# EAGLE design quantum_PSU_V2 (EAGLE 9.5.2)
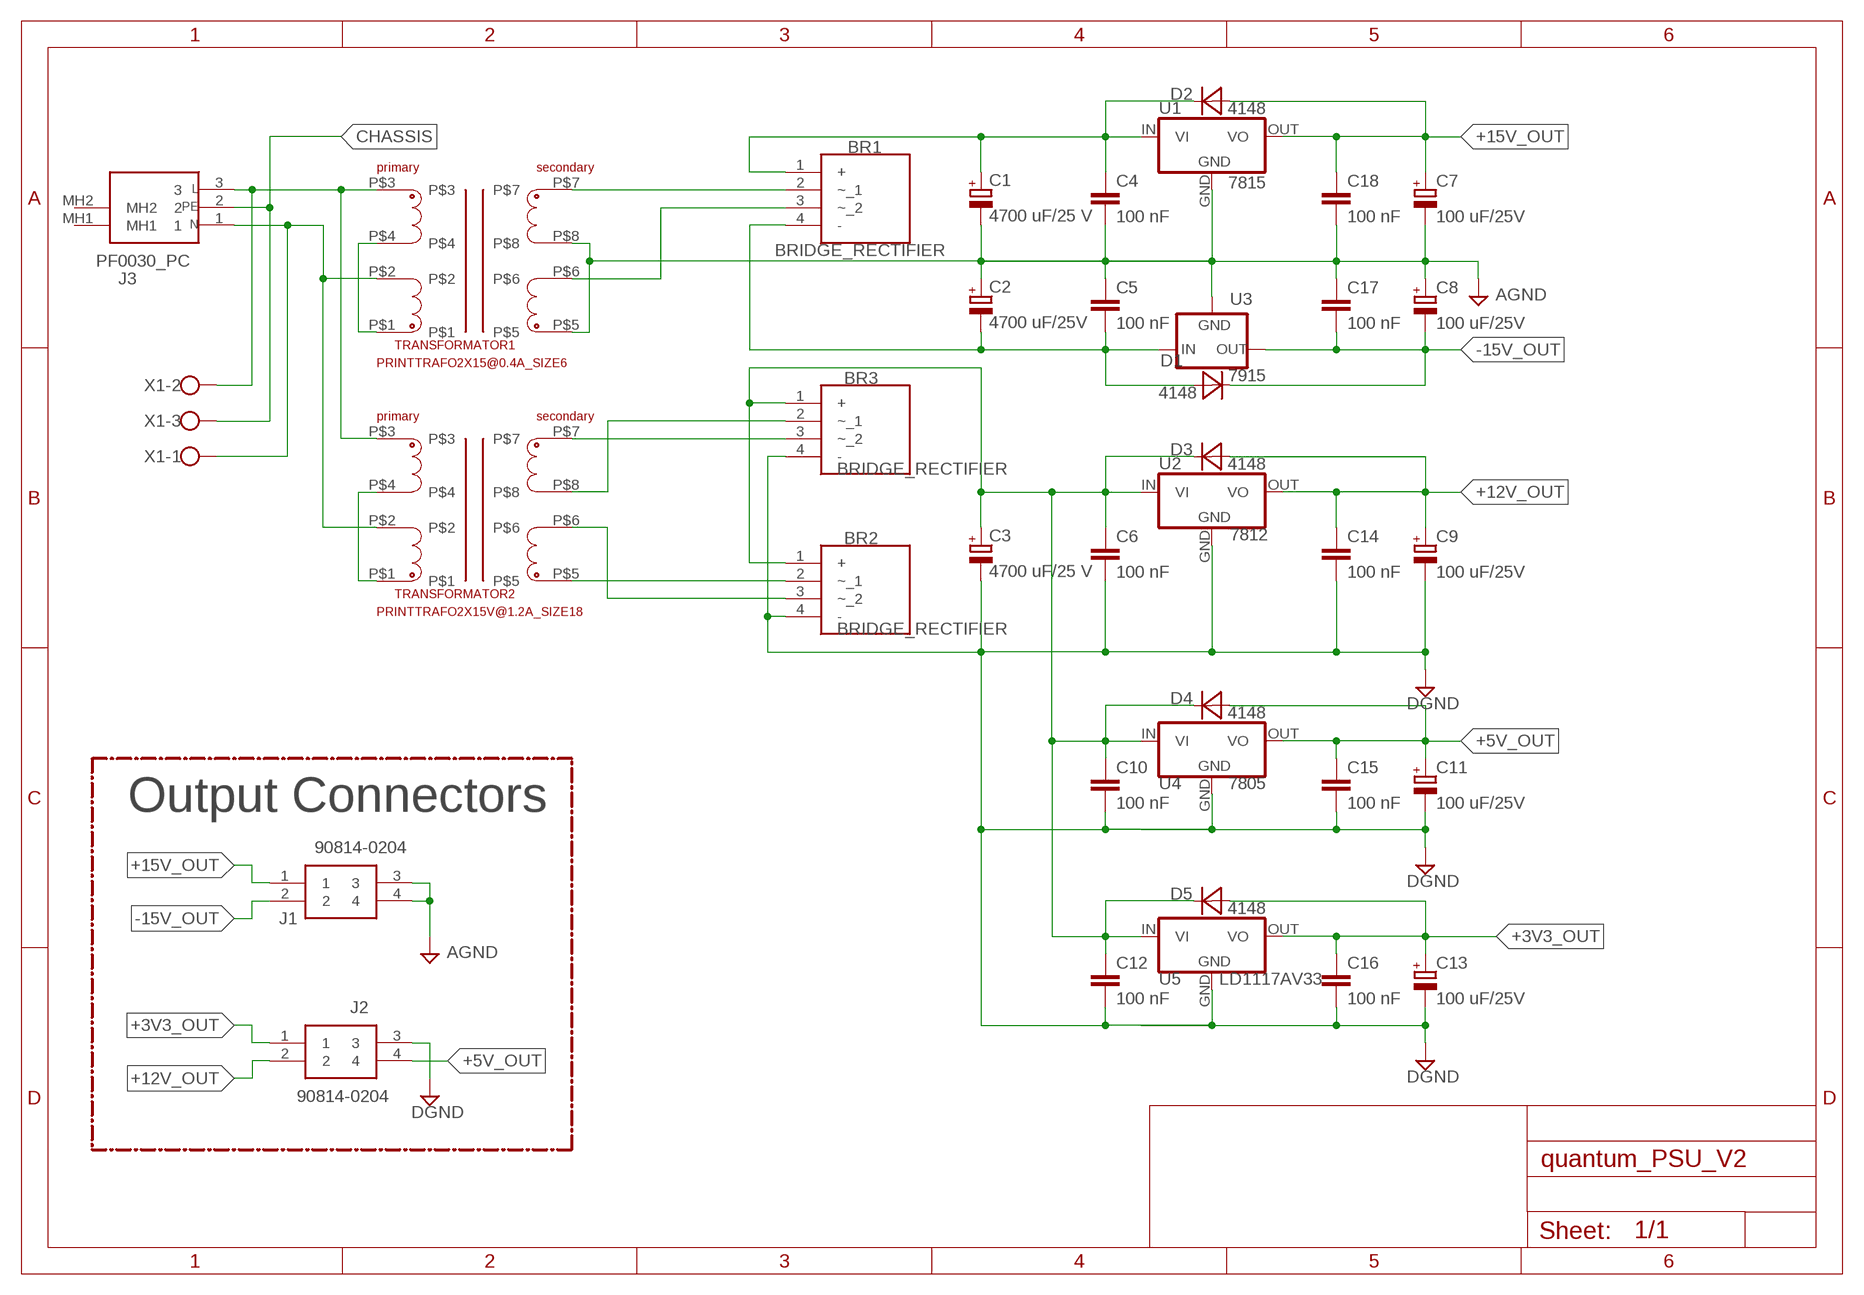
[diagram p0: schematic, sheet 1]

## Parts
BR1  BRIDGE_RECTIFIER  [KBP308G]
BR2  BRIDGE_RECTIFIER  [KBP308G]
BR3  BRIDGE_RECTIFIER  [KBP308G]
C1  4700 uF/25 V  CAPACITOR_ELECTROLYTIC_16MM-THT  [ELECTROLYTIC_16MM]
C2  4700 uF/25V  CAPACITOR_ELECTROLYTIC_16MM-THT  [ELECTROLYTIC_16MM]
C3  4700 uF/25 V  CAPACITOR_ELECTROLYTIC_16MM-THT  [ELECTROLYTIC_16MM]
C4  100 nF  CAPACITOR_5MM  [C5MM]
C5  100 nF  CAPACITOR_5MM  [C5MM]
C6  100 nF  CAPACITOR_5MM  [C5MM]
C7  100 uF/25V  CAPACITOR_ELECTROLYTIC_8MM-THT  [ELECTROLYTIC_8MM]
C8  100 uF/25V  CAPACITOR_ELECTROLYTIC_8MM-THT  [ELECTROLYTIC_8MM]
C9  100 uF/25V  CAPACITOR_ELECTROLYTIC_8MM-THT  [ELECTROLYTIC_8MM]
C10  100 nF  CAPACITOR_5MM  [C5MM]
C11  100 uF/25V  CAPACITOR_ELECTROLYTIC_8MM-THT  [ELECTROLYTIC_8MM]
C12  100 nF  CAPACITOR_5MM  [C5MM]
C13  100 uF/25V  CAPACITOR_ELECTROLYTIC_8MM-THT  [ELECTROLYTIC_8MM]
C14  100 nF  CAPACITOR_5MM  [C5MM]
C15  100 nF  CAPACITOR_5MM  [C5MM]
C16  100 nF  CAPACITOR_5MM  [C5MM]
C17  100 nF  CAPACITOR_5MM  [C5MM]
C18  100 nF  CAPACITOR_5MM  [C5MM]
D1  4148  DIODE_4148_THT  [DIODE_THT_STANDING]
D2  4148  DIODE_4148_THT  [DIODE_THT_STANDING]
D3  4148  DIODE_4148_THT  [DIODE_THT_STANDING]
D4  4148  DIODE_4148_THT  [DIODE_THT_STANDING]
D5  4148  DIODE_4148_THT  [DIODE_THT_STANDING]
J1  90814-0204  [MOLEX_90814-0204]
J2  90814-0204  [MOLEX_90814-0204]
J3  PF0030_PC  [PF0030PC]
TRANSFORMATOR1  PRINTTRAFO2X15@0.4A_SIZE6  [LP_SIZE_6]
TRANSFORMATOR2  PRINTTRAFO2X15V@1.2A_SIZE18  [LPI_SIZE_18]
U1  7815  78_THT  [78XXS_]
U2  7812  78_THT  [78XXS_]
U3  7915  79_THT  [79XXS]
U4  7805  78_THT  [78XXS_]
U5  LD1117AV33  78_THT  [78XXS_]
X1  CONNECTOR_3POL  [W237-103]

## Nets
+3V3_OUT: C13.+ C16.1 D5.A J2.1 U5.OUT(VO)
+5V_OUT: C11.+ C15.1 D4.A J2.4 U4.OUT(VO)
+12V_OUT: C9.+ C14.1 D3.A J2.2 U2.OUT(VO)
+15V_OUT: C7.+ C18.1 D2.A J1.1 U1.OUT(VO)
-15V_OUT: C8.- C17.2 D1.C J1.2 U3.OUT
AGND: C1.- C2.+ C4.2 C5.1 C7.- C8.+ C17.1 C18.2 J1.3 J1.4 TRANSFORMATOR1.P$5 TRANSFORMATOR1.P$8 U1.GND U3.GND
CHASSIS: J3.2 X1.3
DGND: BR2.4(-) BR3.4(-) C3.- C6.2 C9.- C10.2 C11.- C12.2 C13.- C14.2 C15.2 C16.2 J2.3 U2.GND U4.GND U5.GND
N$1: BR3.3(~_2) TRANSFORMATOR2.P$7
N$2: BR2.1(+) BR3.1(+) C3.+ C6.1 C10.1 C12.1 D3.C D4.C D5.C U2.IN(VI) U4.IN(VI) U5.IN(VI)
N$3: BR1.3(~_2) TRANSFORMATOR1.P$6
N$4: TRANSFORMATOR1.P$1 TRANSFORMATOR1.P$4
N$5: TRANSFORMATOR2.P$1 TRANSFORMATOR2.P$4
N$6: BR3.2(~_1) TRANSFORMATOR2.P$8
N$7: BR2.3(~_2) TRANSFORMATOR2.P$6
N$8: J3.3 TRANSFORMATOR1.P$3 TRANSFORMATOR2.P$3 X1.2
N$9: J3.1 TRANSFORMATOR1.P$2 TRANSFORMATOR2.P$2 X1.1
N$11: BR1.2(~_1) TRANSFORMATOR1.P$7
N$12: BR2.2(~_1) TRANSFORMATOR2.P$5
N$15: BR1.1(+) C1.+ C4.1 D2.C U1.IN(VI)
N$17: BR1.4(-) C2.- C5.2 D1.A U3.IN
Unconnected: J3.MH1 J3.MH2

## Notes on the sheet
- Output Connectors

## Library data of the parts
BR1-BR3 = passive components:BRIDGE_RECTIFIER: Bridge Rectifiers Bridge Rectifier KBP Source: Datasheet <https://componentsearchengine.com/Datasheets/1/KBP308G.pdf>; DESCRIPTION: Bridge Rectifiers Bridge Rectifier KBP; HEIGHT: 3mm; MANUFACTURER_NAME: Diodes Inc.; MANUFACTURER_PART_NUMBER: KBP308G; MOUSER_PART_NUMBER: 621-KBP308G; MOUSER_PRICE-STOCK: https://www.mouser.com/Search/Refine.aspx?Keyword=621-KBP308G
C1-C3 C7-C9 C11 C13 = passive components:CAPACITOR_ELECTROLYTIC: Electrolytic Capacitor SMD
C4-C6 C10 C12 C14-C18 = passive components:CAPACITOR: ceramic capacitor
D1-D5 = passive components:DIODE: Standard 4148 Diode SOD323 Format; MOUSER_PART_NUMBER: ...
J1 J2 = electro_mechanical:90814-0204: CONN HEADER 4POS 1.27MM SMD TIN Source: Datasheet <https://componentsearchengine.com/Datasheets/1/90814-0204.pdf>; DESCRIPTION: CONN HEADER 4POS 1.27MM SMD TIN; HEIGHT: mm; MANUFACTURER_NAME: Molex; MANUFACTURER_PART_NUMBER: 90814-0204; MOUSER_PART_NUMBER: 538-90814-0204; MOUSER_PRICE-STOCK: https://www.mouser.com/Search/Refine.aspx?Keyword=538-90814-0204
J3 = electro_mechanical:PF0030_PC: Bulgin C14 Right Angle Through Hole IEC Plug Male, 10A, 250 V ac Source: Datasheet <https://componentsearchengine.com/Datasheets/1/PF0030_PC.pdf>; DESCRIPTION: Bulgin C14 Right Angle Through Hole IEC Plug Male, 10A, 250 V ac; HEIGHT: 35.8mm; MANUFACTURER_NAME: Bulgin; MANUFACTURER_PART_NUMBER: PF0030/PC; MOUSER_PART_NUMBER: 161-PF0030/PC; MOUSER_PRICE-STOCK: https://www.mouser.com/Search/Refine.aspx?Keyword=161-PF0030%2FPC
TRANSFORMATOR1 = passive components:PRINTTRAFO: Printtrafo several siyes availlable; MOUSER_PART_NUMBER: 530-LP-30-200
TRANSFORMATOR2 = passive components:PRINTTRAFO: Printtrafo several siyes availlable; MOUSER_PART_NUMBER: 530-30-600-LPI
U1 U2 U4 U5 = passive components:78**
U3 = passive components:79**: VOLTAGE REGULATOR
X1 = electro_mechanical:CONNECTOR: WAGO SCREW CLAMP

## Board
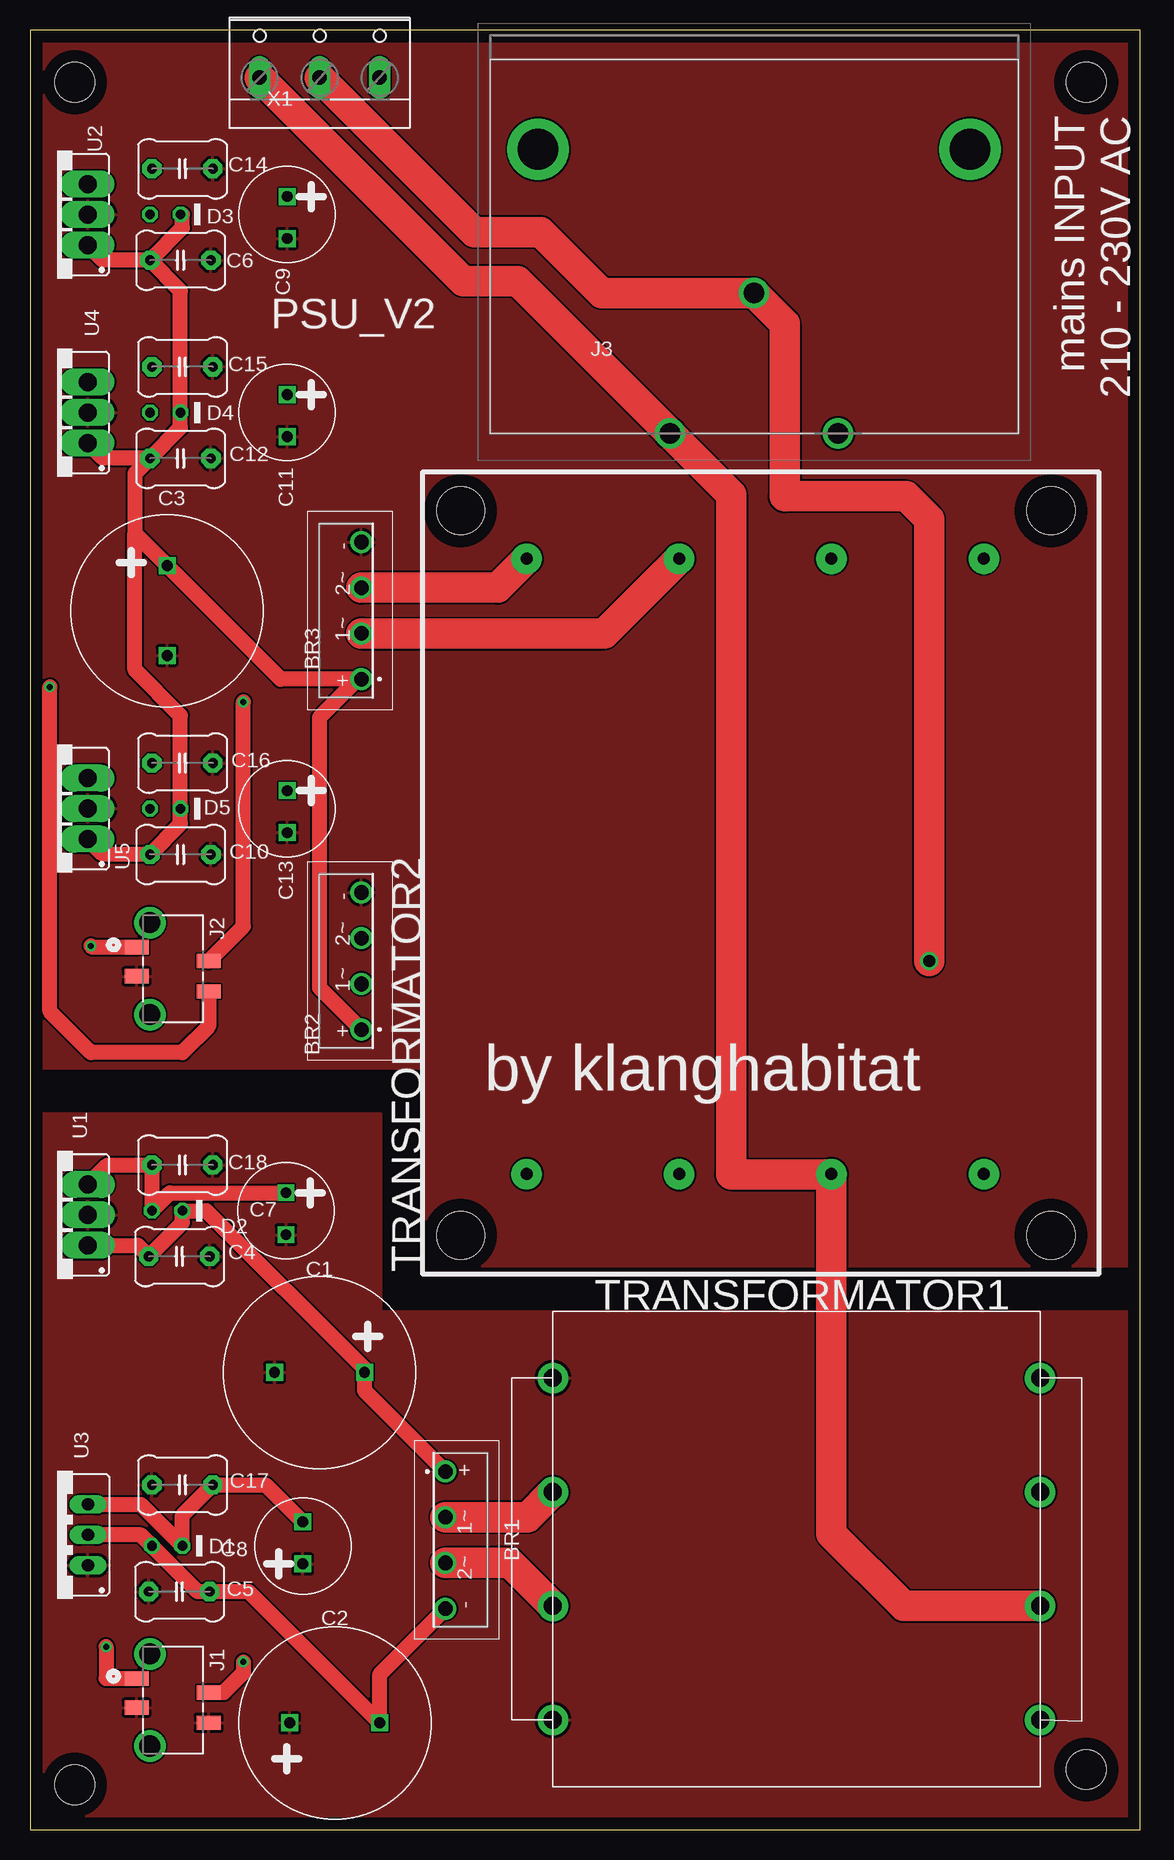
[diagram p1: board, top side]
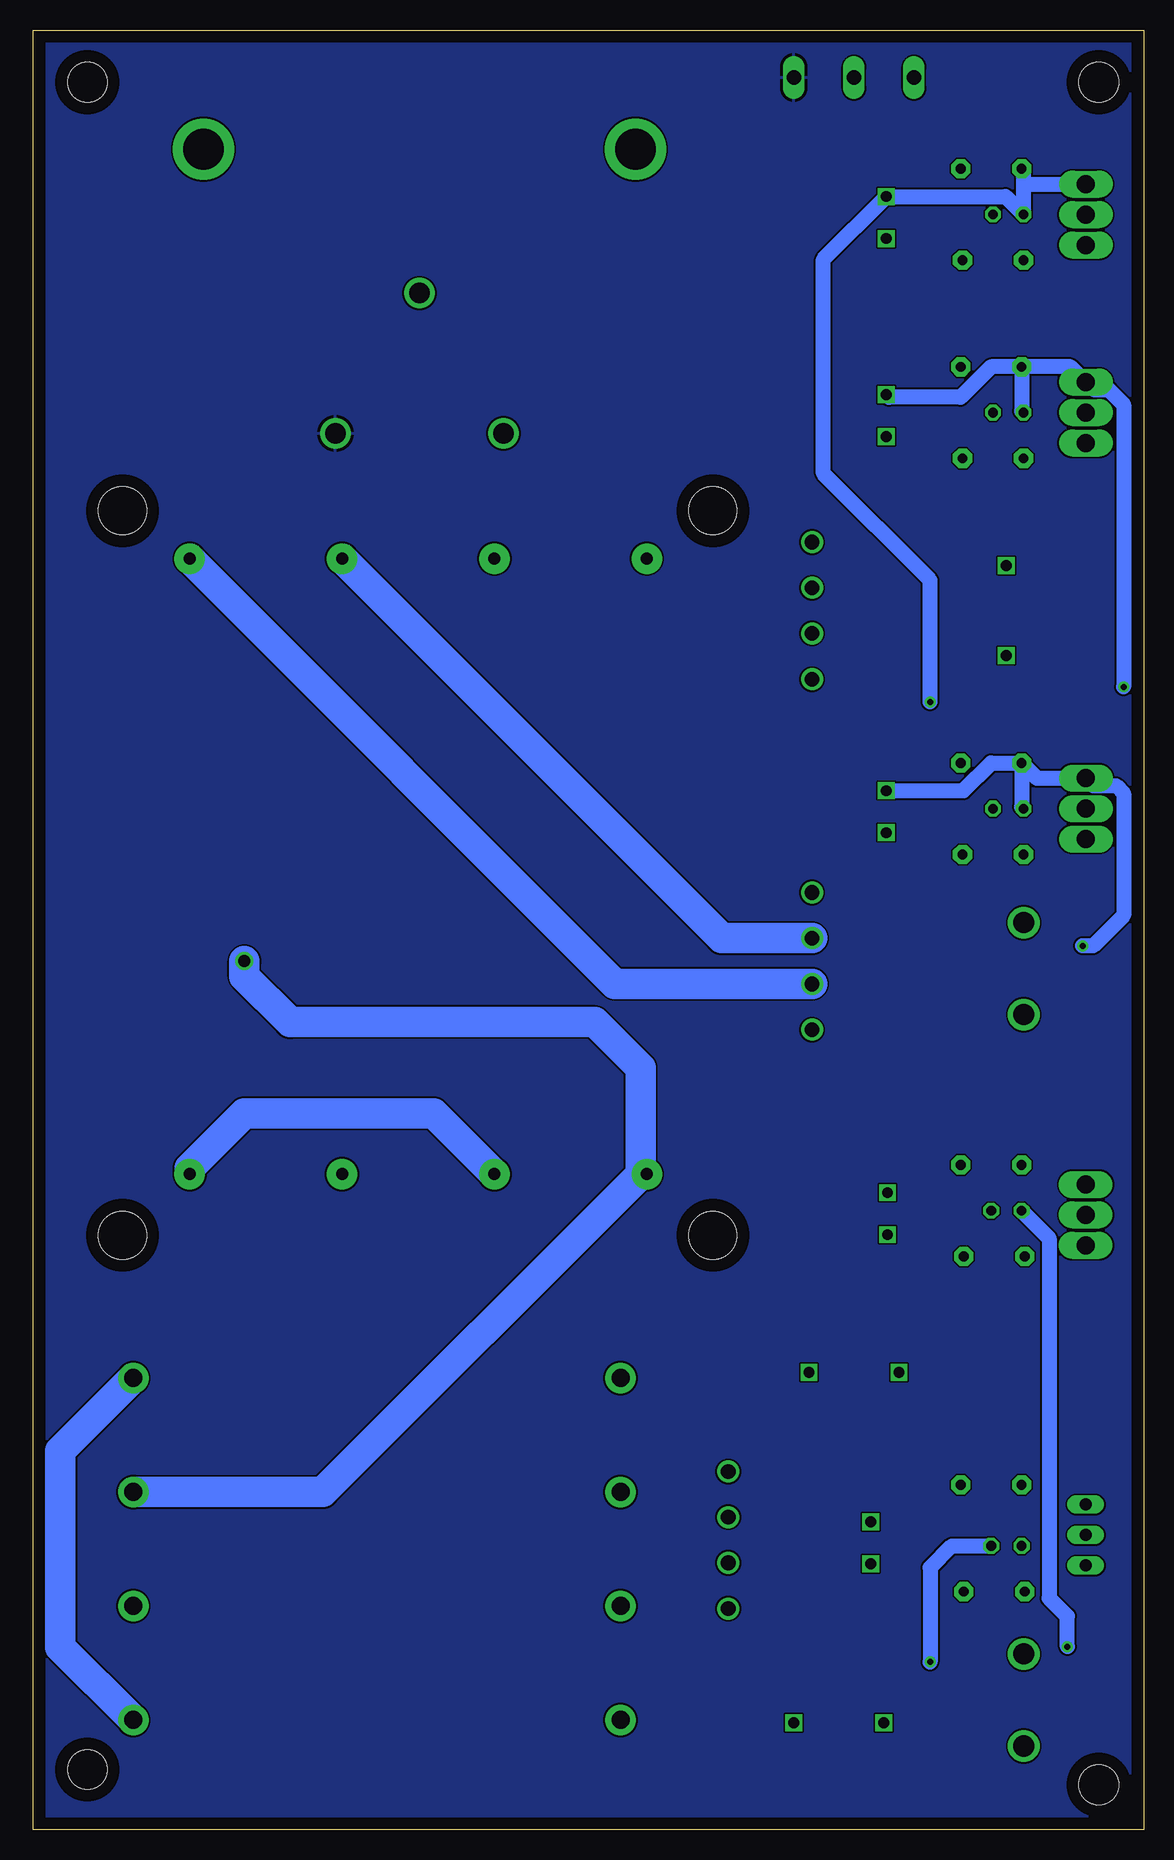
[diagram p2: board, bottom side, seen from below]

Size 92.54 x 150 mm. Coordinates in mm from the lower left corner, seen from the top.
Outline: 0,0 92.54,0 92.54,150 0,150 0,0
Copper layers (1*16): Top 0.035mm / dielectric 1.5mm / Bottom 0.035mm
Design rules "default *": minimum track width 6mil, minimum drill 0.35mm, track to track 6mil, track to pad 6mil, pad to pad 5mil, via to via 6mil, smd to smd 6mil, copper to edge 40mil, drill to drill 6mil, minimum pad ring 10mil, minimum via ring 8mil, stop-mask expansion 4mil, vias tented up to drill 0mil, thermal gap 10mil
Holes 3.3 mm at 3.73,3.73 3.73,145.64 88.01,145.64 88.01,5

### Footprints (pad centres in the part's own frame; a part is rotated, then mirrored left to right if it is on the bottom)
KBP308G = drill 1.22 pad 1.83: 1 -5.715,-0.95; 2 -1.905,-0.95; 3 1.905,-0.95; 4 5.715,-0.95
ELECTROLYTIC_16MM = drill 0.9 square: + -3.75,0; - 3.75,0
C5MM = drill 0.813 pad 1.6 octagon: 1 -1.27,0; 2 3.81,0
ELECTROLYTIC_8MM = drill 0.9 square: + -1.5,0; - 2,0
DIODE_THT_STANDING = drill 0.813 octagon: A 0,0; C -2.54,0
MOLEX_90814-0204 = smd 1.194 x 2.007: 1 0.127,0; 2 1.27,5.994; 3 2.54,0; 4 3.81,5.994 | drill 1.753 pad 2.629: 5 -1.93,1.092; 6 5.74,1.092
PF0030PC = drill 1.7 pad 2.55: 1 0,0; 2 14,0; 3 7,11.7 | drill 3.4 pad 5.1: MH1 -11,23.7; MH2 25,23.7
LP_SIZE_6 = drill 1.5 pad 2.54: P$1 3.45,34.05; P$2 3.45,24.55; P$3 3.45,15.05; P$4 3.45,5.55; P$5 44.05,34.05; P$6 44.05,24.55; P$7 44.05,15.05; P$8 44.05,5.55
LPI_SIZE_18 = drill 1 pad 2.54: P$1 5.1,5.6; P$2 5.1,18.3; P$3 5.1,43.7; P$4 5.1,31; P$5 56.4,5.6; P$6 56.4,18.3; P$7 56.4,43.7; P$8 56.4,31 | hole 4: 0,0; 60.4,0; 0,49.2; 60.4,49.2
78XXS_ = drill 1.499 pad 1.93 long: GND 0,-2.54; IN -2.54,-2.54; OUT 2.54,-2.54
79XXS = drill 1.016 long: GND -2.54,-2.54; IN 0,-2.54; OUT 2.54,-2.54
W237-103 = drill 1.194 long: 1 -5,-1.29; 2 0,-1.29; 3 5,-1.29

### Placement (x,y rotation side)
BR1  35.56,24.13 270 top
BR2  26.67,72.39 90 top
BR3  26.67,101.6 90 top
C1  24.13,38.1 180 top
C2  25.4,8.89 0 top
C3  11.43,101.6 270 top
C4  11.18,47.77 0 top
C5  11.18,19.83 0 top
C6  11.27,130.81 0 top
C7  21.34,51.58 270 top
C8  22.73,23.64 90 top
C9  21.43,134.62 270 top
C10  11.27,81.28 0 top
C11  21.43,118.11 270 top
C12  11.27,114.3 0 top
C13  21.43,85.09 270 top
C14  11.43,138.43 0 top
C15  11.43,121.92 0 top
C16  11.43,88.9 0 top
C17  11.43,28.72 0 top
C18  11.43,55.39 0 top
D1  10.16,23.64 180 top
D2  10.16,51.58 180 top
D3  10,134.62 180 top
D4  10,118.11 180 top
D5  10,85.09 180 top
J1  8.89,12.7 270 top
J2  8.89,73.66 270 top
J3  53.34,116.37 0 top
TRANSFORMATOR1  87.63,43.18 180 top
TRANSFORMATOR2  85.09,49.53 90 top
U1  2.29,51.23 90 top
U2  2.27,134.62 90 top
U3  2.29,24.56 90 top
U4  2.27,118.11 90 top
U5  2.27,85.09 90 top
X1  24.13,147.32 0 top

### Tracks (layer width: path | path; a pad name or v marks a point on that pad's centre or on a via)
+3V3_OUT  (via drill 0.5)
  Top 1.27: v5.08,73.66 5.21,73.53 J2.1
  Bottom 1.27: C13.+ 15.01,86.59 12.7,88.9 C16.1 | C16.1 8.89,87.63 U5.OUT 4.18,87 2.29,87 1.65,86.36 1.65,76.2 4.19,73.66 v5.08,73.66 | C16.1 10.16,85.25 D5.A
+5V_OUT  (via drill 0.5)
  Top 1.27: J2.4 14.88,66.95 12.7,64.77 5.08,64.77 1.65,68.2 v1.65,95.25
  Bottom 1.27: v1.65,95.25 1.65,118.78 2.89,120.02 4.18,120.02 U4.OUT 6.08,121.92 C15.1 | C15.1 10.16,118.27 D4.A | C15.1 12.7,121.92 15.24,119.38 21.2,119.38 C11.+
+12V_OUT  (via drill 0.5)
  Top 1.27: J2.2 17.78,75.29 v17.78,93.98
  Bottom 1.27: v17.78,93.98 17.78,104.14 26.67,113.03 26.67,130.88 C9.+ 11.5,136.12 D3.A 10,137.16 | 10,137.16 10,138.27 C14.1 | 10,137.16 U2.OUT
+15V_OUT  (via drill 0.5)
  Top 1.27: U1.OUT 6.45,55.39 C18.1 D2.A 11.66,53.08 C7.+ | J1.1 6.35,12.57 v6.35,15.24
  Bottom 1.27: D2.A 7.86,49.28 7.86,19.29 6.35,17.78 v6.35,15.24
-15V_OUT  (via drill 0.5)
  Top 1.27: U3.OUT 9.24,27.1 D1.C 12.7,26.18 C17.2 19.65,28.72 C8.- | J1.2 16.15,11.43 17.78,13.06 v17.78,13.97
  Bottom 1.27: D1.C 15.96,23.64 17.78,21.82 v17.78,13.97
AGND
  pour Top: -2.54,59.69 29.21,59.69 29.21,43.18 93.98,43.18 93.98,-1.27 -2.54,-1.27
CHASSIS
  pour Bottom: -3.81,152.4 -3.81,-2.54 95.25,-2.54 95.25,152.4
DGND
  pour Top: -2.54,63.5 33.02,63.5 33.02,46.99 93.98,46.99 93.98,151.13 -2.54,151.13
N$1
  Top 2.54: TRANSFORMATOR2.P$7 38.97,103.5 BR3.3
N$2
  Top 1.27: BR2.1 24.13,70.17 24.13,92.71 27.3,95.89 BR3.1 20.89,95.89 C3.+ 8.73,108.05 | 8.73,108.05 8.73,113.03 C12.1 | C12.1 12.54,116.84 D4.C 12.54,128.27 C6.1 | C6.1 12.7,133.51 12.7,134.62 D3.C | C6.1 6.08,130.81 U2.IN | C12.1 6.08,114.3 U4.IN | 8.73,108.05 8.73,96.68 12.54,92.87 D5.C 12.54,83.82 C10.1 6.08,81.28 U5.IN
N$3
  Top 2.54: TRANSFORMATOR1.P$6 39.98,22.23 BR1.3
N$4
  Bottom 2.54: TRANSFORMATOR1.P$4 90.25,31.56 90.25,15.2 TRANSFORMATOR1.P$1
N$5
  Bottom 2.54: TRANSFORMATOR2.P$4 59.15,59.69 74.93,59.69 79.49,55.13 TRANSFORMATOR2.P$1
N$6
  Top 2.54: BR3.2 47.85,99.69 TRANSFORMATOR2.P$8
N$7
  Bottom 2.54: TRANSFORMATOR2.P$6 35.16,74.3 BR2.3
N$8  (via drill 1)
  Top 2.54: X1.2 37.01,133.15 42.56,133.15 47.64,128.07 J3.3 62.88,125.53 62.88,111.13 73.02,111.13 74.93,109.22 v74.93,72.39
  Bottom 2.54: TRANSFORMATOR1.P$3 68.39,28.13 41.91,54.61 | 41.91,54.61 41.91,63.5 45.72,67.31 71.12,67.31 74.93,71.12 v74.93,72.39 | TRANSFORMATOR2.P$3 41.89,54.63 41.91,54.61
N$9
  Top 2.54: X1.1 36.09,129.07 40.64,129.07 J3.1 58.42,111.29 58.42,54.61 66.77,54.61 TRANSFORMATOR2.P$2 66.79,24.65 72.81,18.63 TRANSFORMATOR1.P$2
N$11
  Top 2.54: TRANSFORMATOR1.P$7 41.48,26.04 BR1.2
N$12
  Bottom 2.54: BR2.2 44.05,70.48 TRANSFORMATOR2.P$5
N$15
  Top 1.27: BR1.1 27.88,36.58 C1.+ 27.88,38.39 14.69,51.58 D2.C 12.7,50.56 C4.1 8.99,48.69 U1.IN
N$17
  Top 1.27: BR1.4 29.15,12.96 C2.- 18.21,19.83 C5.2 13.97,19.83 D1.A 9.24,24.56 U3.IN

### Text on the board
tNames: mains INPUT / 210 - 230V AC | PSU_V2 | by klanghabitat